# Altium schematic sheet DigitalCapture.SchDoc: Digital Capture
size A; DocumentNumber: 5; SheetNumber: 5; SheetTotal: 9
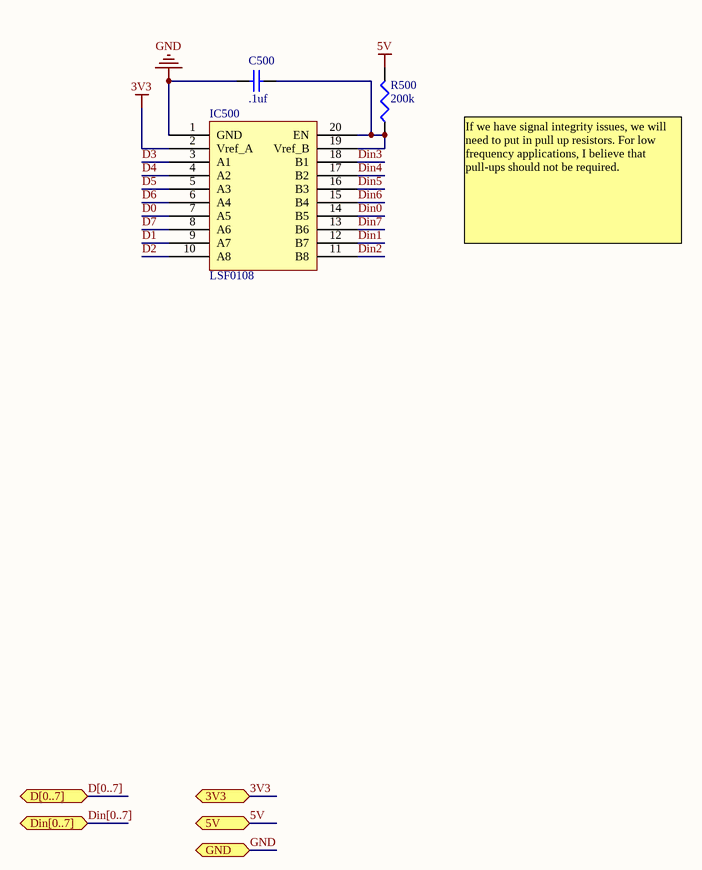
[diagram p0: DigitalCapture.SchDoc]

## Parts
C500  value .1uf  [SMD0603]  (hidden comment: Cap)
IC500  LSF0108  [TSSOP-20]
R500  value 200k  [SMD0603]  (hidden comment: Res)

## Ports
3V3, 5V, D[0..7], Din[0..7], GND

## Nets
3V3: IC500.2(Vref_A) ; port 3V3
5V: R500.2 ; port 5V
GND: C500.2 IC500.1(GND) ; port GND
D0: IC500.7(A5)
D1: IC500.9(A7)
D2: IC500.10(A8)
D3: IC500.3(A1)
D4: IC500.4(A2)
D5: IC500.5(A3)
D6: IC500.6(A4)
D7: IC500.8(A6)
Din0: IC500.14(B5)
Din1: IC500.12(B7)
Din2: IC500.11(B8)
Din3: IC500.18(B1)
Din4: IC500.17(B2)
Din5: IC500.16(B3)
Din6: IC500.15(B4)
Din7: IC500.13(B6)
NetC500_1: C500.1 IC500.19(Vref_B) IC500.20(EN) R500.1

## Buses and harness runs
bus D[0..7] = port D[0..7]
bus Din[0..7] = port Din[0..7]

## Notes on the sheet
- If we have signal integrity issues, we will need to put in pull up resistors. For low frequency applications, I believe that pull-ups should not be required.

## Library data of the parts
C500 = Capacitor Ceramic: Ceramic Chip Capacitor
IC500 = LSF0108: 8 bit 5V to 3.3V level shifter
R500 = Resistor